# EasyEDA Pro project ProProject_语音光敏控制led_2025-12-18.epro

# Schematic Schematic1
Create Date: 2024-08-23; Page Name: P1; Project Name: 语音光敏控制led; Schematic Name: Schematic1; Update Date: 2024-08-24; Company: 嘉立创EDA; Page Size: A4; Version: V1.0
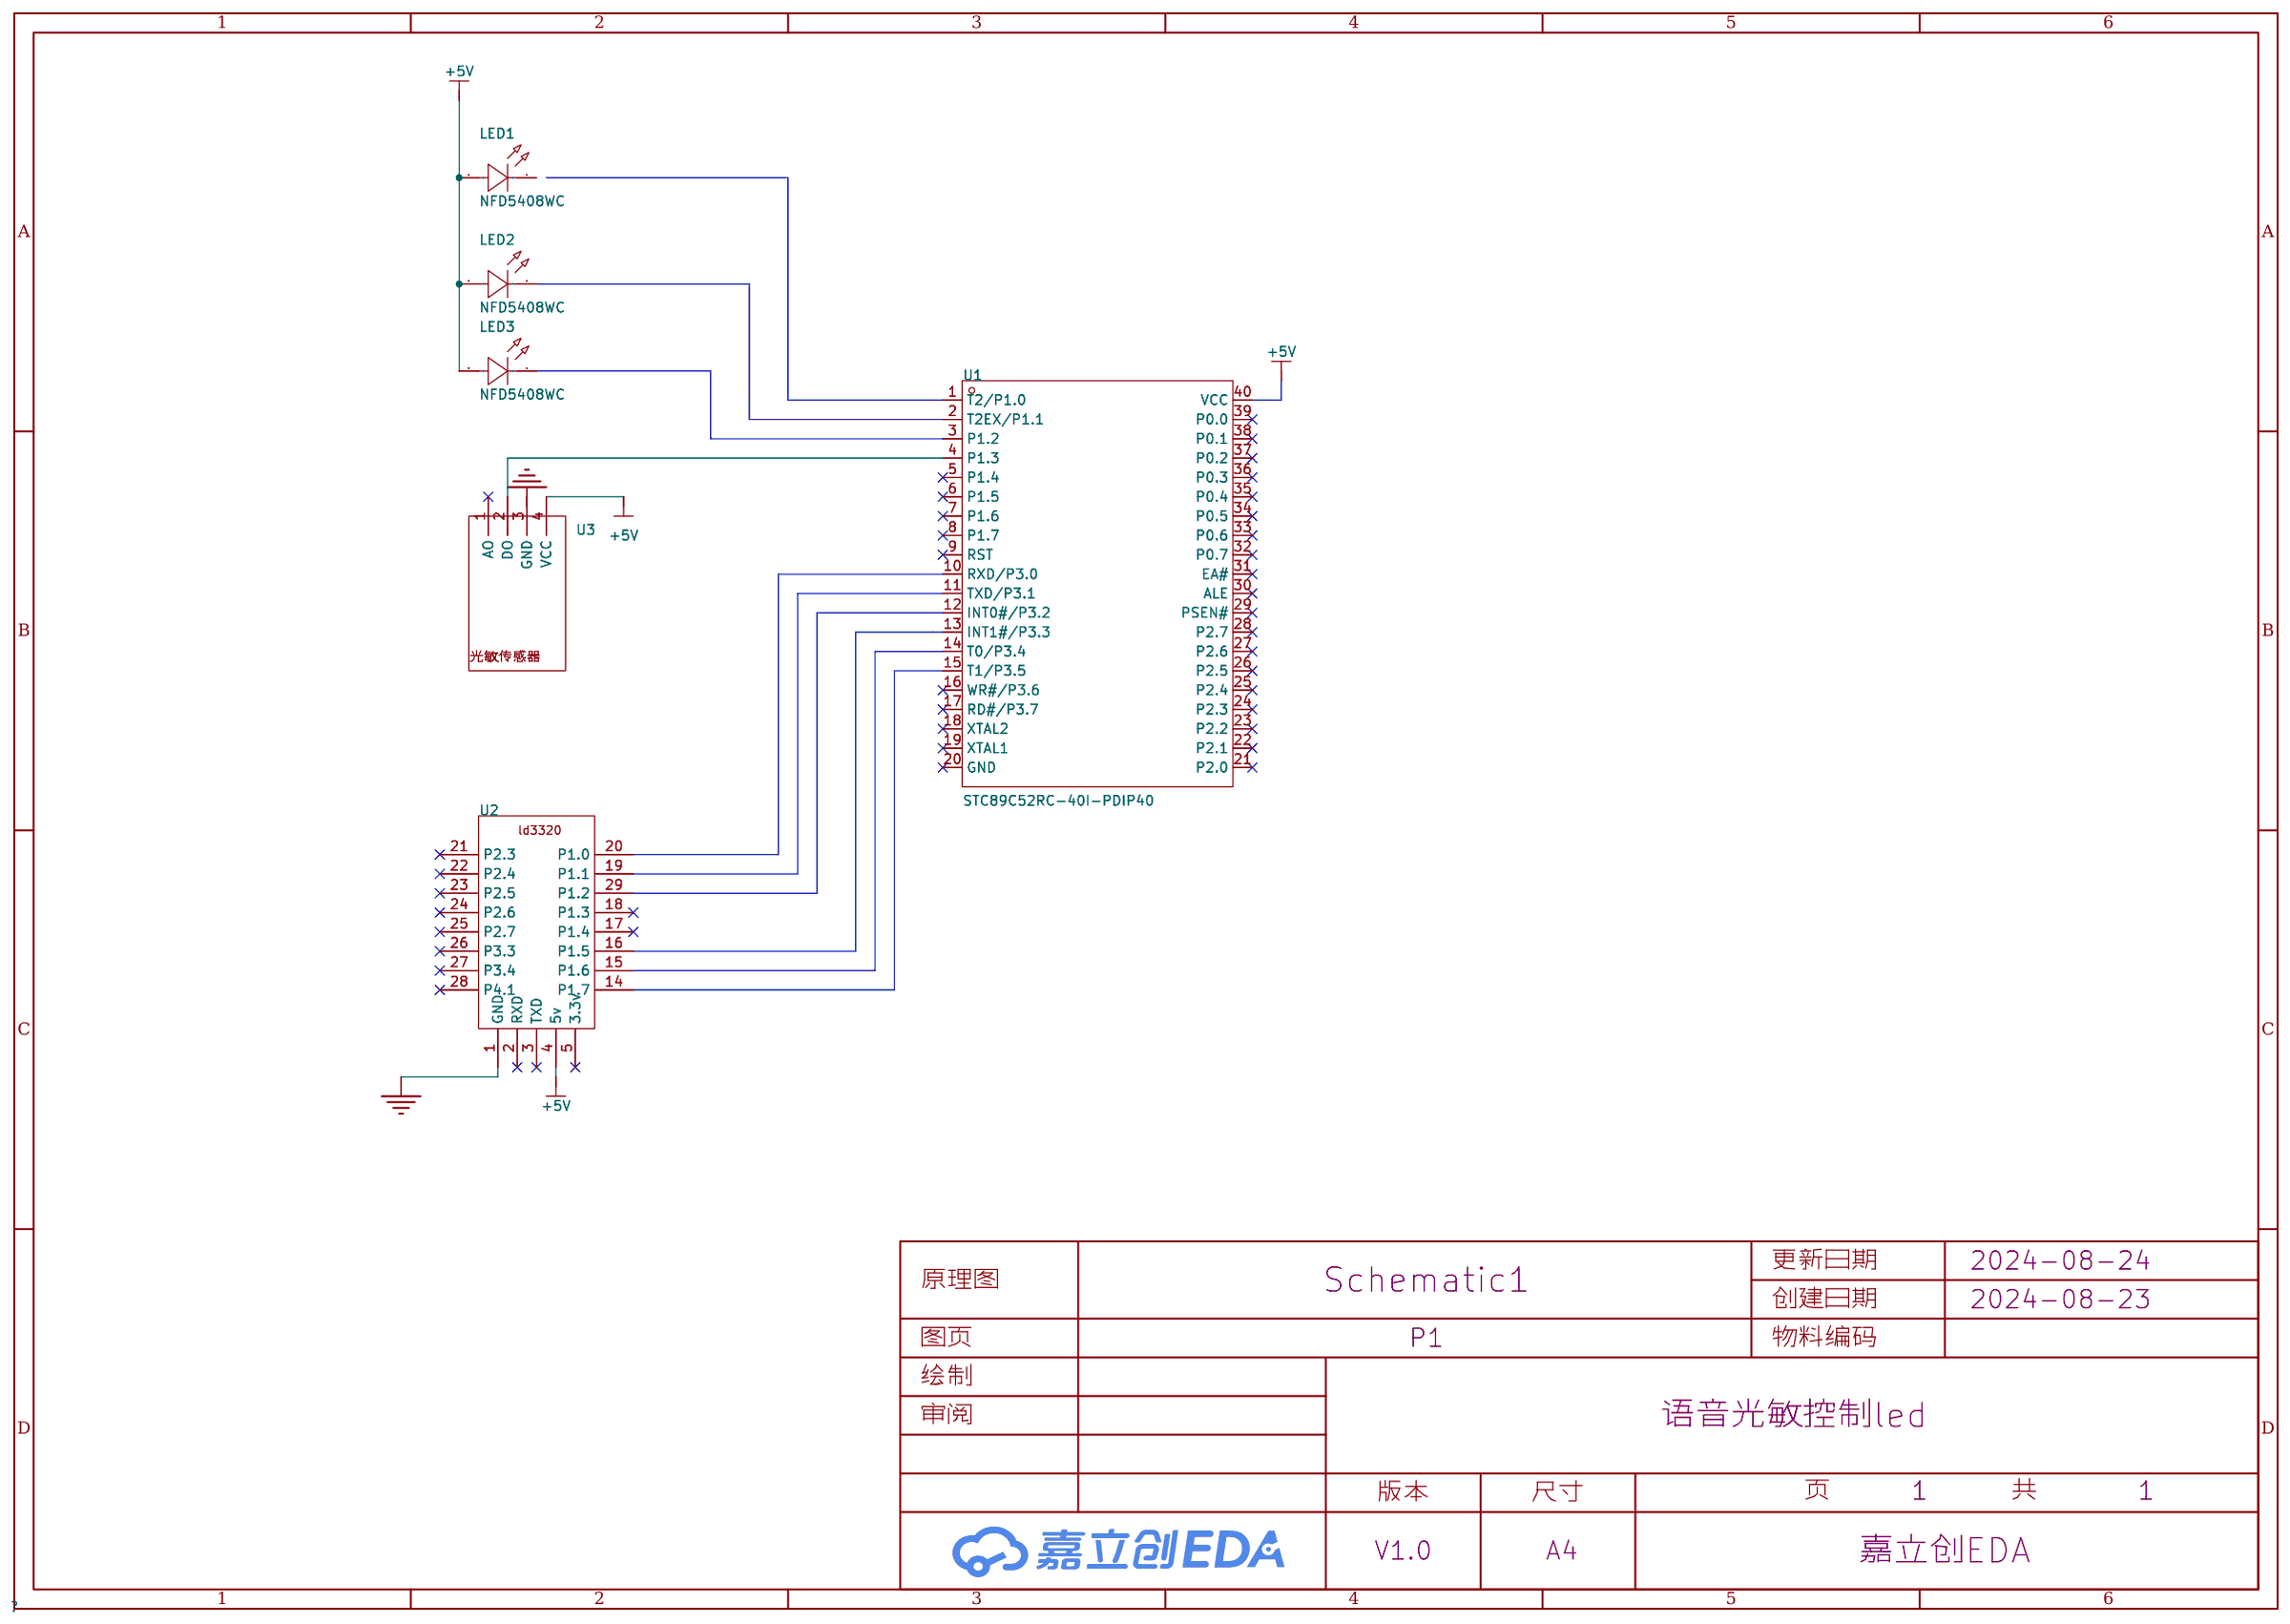
[diagram p0: schematic sheet]

## Parts
LED1  NFD5408WC  [LED-TH_BD5.8-P2.54-RD]
LED2  NFD5408WC  [LED-TH_BD5.8-P2.54-RD]
LED3  NFD5408WC  [LED-TH_BD5.8-P2.54-RD]
U1  STC89C52RC-40I-PDIP40  [DIP-40_L52.0-W13.7-P2.54-LS15.2-BL]
U2  -
U3  -

## Library data of the parts
LED1-LED3 = NFD5408WC: 发光颜色:白色;功率:200mW;发光角度:20°;工作温度:-30℃~+85℃;; LCSC Part Name: 发光二极管/LED; Supplier Part: C20618159; Manufacturer: 国星光电; Supplier Footprint: 插件,D=5mm; JLCPCB Part Class: 扩展库; Datasheet: https://atta.szlcsc.com/upload/public/pdf/source/20240202/7B5078E05D58ED4BBFF174CFF9D8F172.pdf; Supplier: LCSC; Emitted Color: 白色; Power Dissipation: 200mW; Viewing Angle: 20°; Operating Temperature: -30℃~+85℃
U1 = STC89C52RC-40I-PDIP40: CPU内核:51系列;程序存储容量:8KB;RAM总容量:512Byte;GPIO端口数量:35;工作电压范围:3.3V~5.5V;CPU最大主频:-;程序存储器类型:FLASH;; Supplier Part: C14022; Manufacturer: STC(宏晶); Supplier Footprint: DIP-40; JLCPCB Part Class: 扩展库; Datasheet: https://atta.szlcsc.com/upload/public/pdf/source/20210104/C14022_3E6032FDBB5DBC6F971AD019A8472F5B.pdf; Supplier: LCSC; CPU Core: 51系列; Program Storage Size: 8KB; RAM Size: 512Byte; GPIO Ports Number: 35; Operating Voltage Range: 3.3V~5.5V; Program Memory Type: FLASH; Operating Temperature Range: -40℃~+85℃; 16Bit Timer: 3; UART/USART: 1; Peripheral/Function: 看门狗; Watchdog: 有
U2 = LD3320
U3 = 光敏传感器

## Nets
+5V: LED1.2(A) LED2.2(A) LED3.2(A) U2.4(5v) U3.4(VCC)
GND: U2.1(GND) U3.3(GND)
Net-(U1-4): U1.4(P1.3) U3.2(DO)

Not connected (* = marked no-connect by the designer): LED1 1(K); LED2 1(K); LED3 1(K); U1 1(T2/P1.0) 2(T2EX/P1.1) 3(P1.2) 5(P1.4)* 6(P1.5)* 7(P1.6)* 8(P1.7)* 9(RST)* 10(RXD/P3.0) 11(TXD/P3.1) 12(INT0#/P3.2) 13(INT1#/P3.3) 14(T0/P3.4) 15(T1/P3.5) 16(WR#/P3.6)* 17(RD#/P3.7)* 18(XTAL2)* 19(XTAL1)* 20(GND)* 21(P2.0)* 22(P2.1)* 23(P2.2)* 24(P2.3)* 25(P2.4)* 26(P2.5)* 27(P2.6)* 28(P2.7)* 29(PSEN#)* 30(ALE)* 31(EA#)* 32(P0.7)* 33(P0.6)* 34(P0.5)* 35(P0.4)* 36(P0.3)* 37(P0.2)* 38(P0.1)* 39(P0.0)* 40(VCC); U2 2(RXD)* 3(TXD)* 5(3.3v)* 14(P1.7) 15(P1.6) 16(P1.5) 17(P1.4)* 18(P1.3)* 19(P1.1) 20(P1.0) 21(P2.3)* 22(P2.4)* 23(P2.5)* 24(P2.6)* 25(P2.7)* 26(P3.3)* 27(P3.4)* 28(P4.1)* 29(P1.2); U3 1(AO)*
